# EAGLE schematic brick_serial_ble (EAGLE 7.2.0)
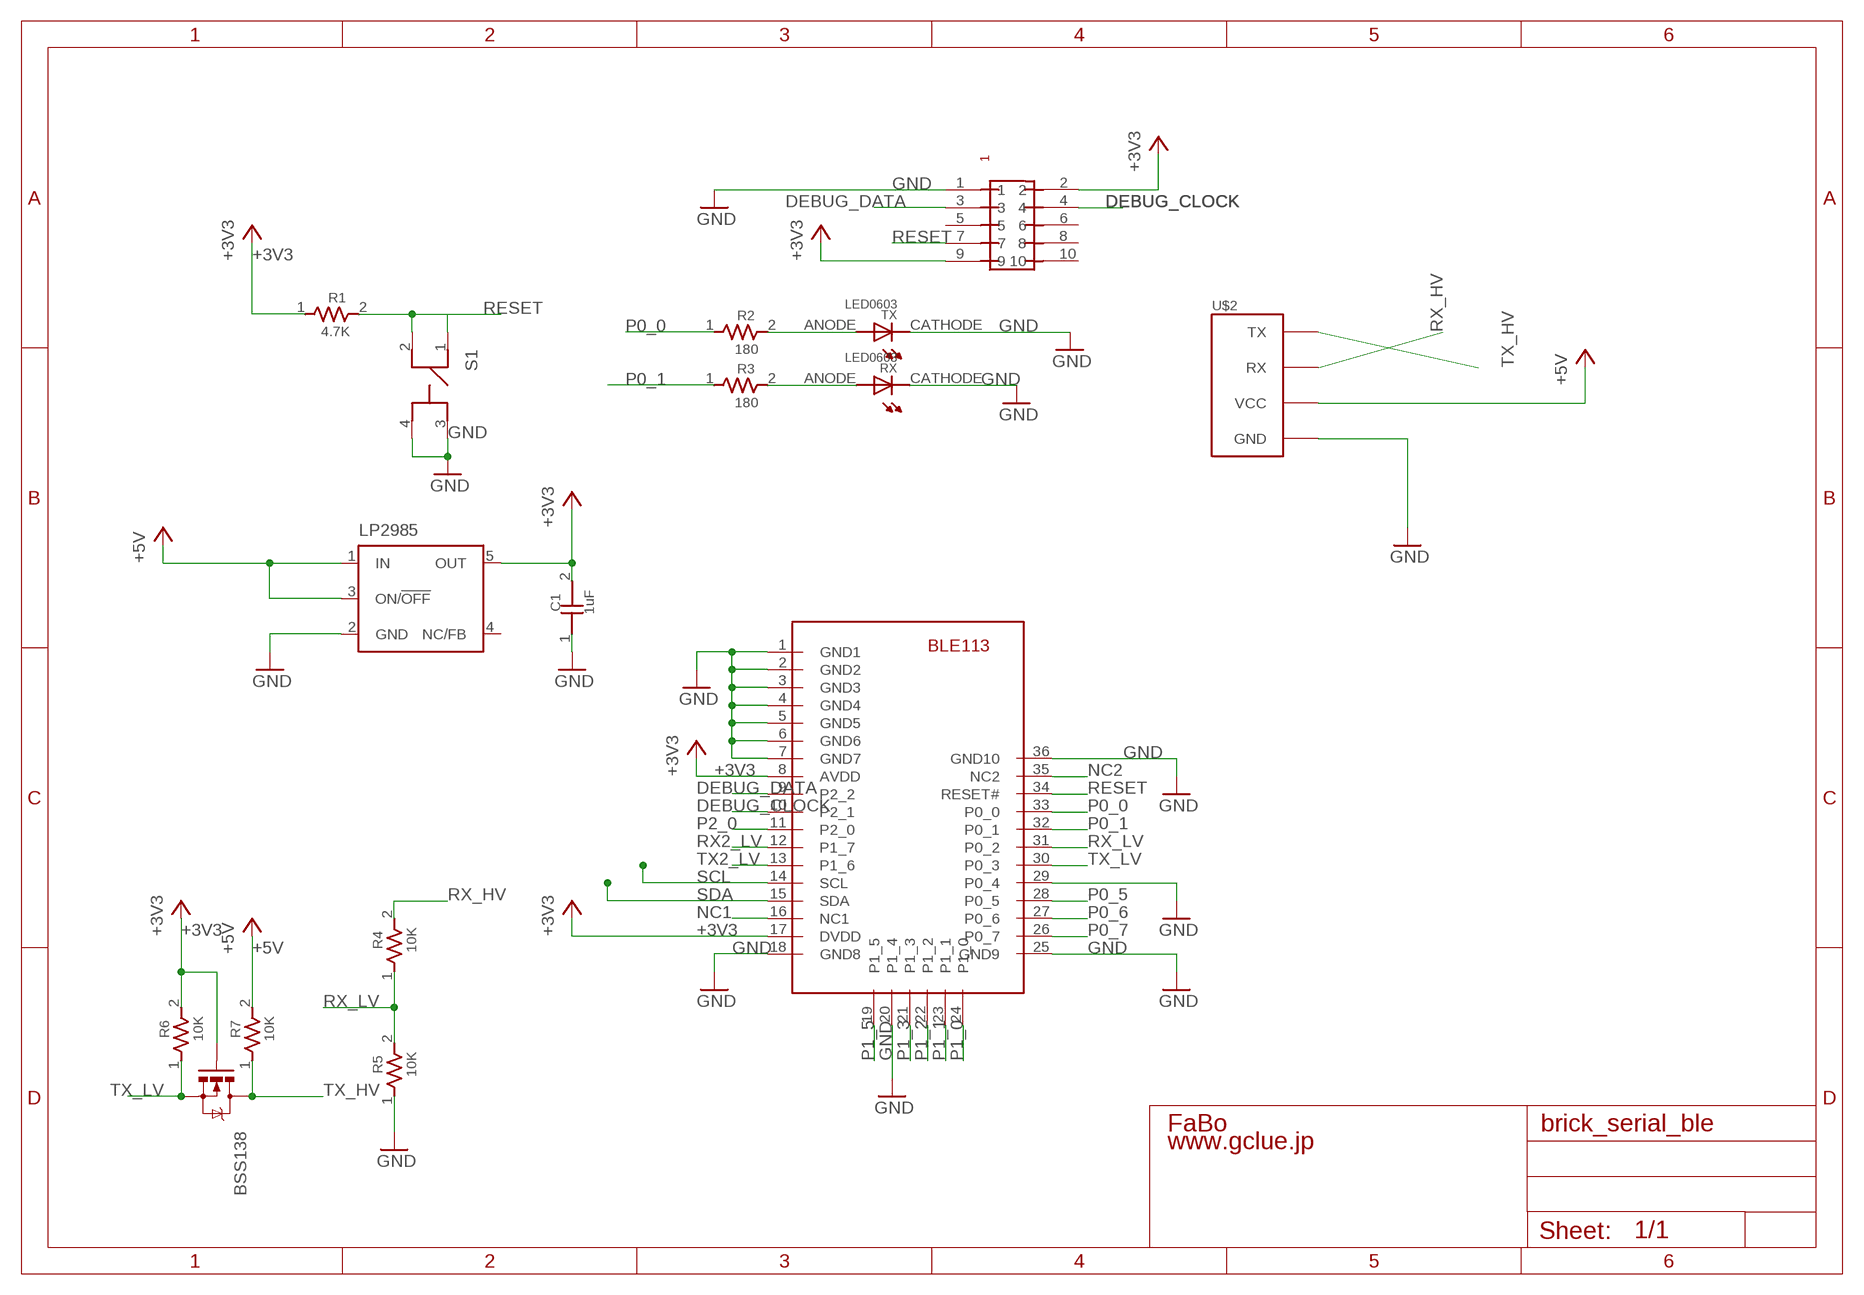
[diagram p0: schematic, sheet 1]

## Parts
BSS138  MOSFET-NCHANNELSMD  [SOT23-3]
C1  1uF  CAPACITOR0603  [0603]
LP2985  LP2985-XXDBVR33  [SOT23-DBV]
R1  4.7K  RESISTOR0603  [0603]
R2  180  RESISTOR0603  [0603]
R3  180  RESISTOR0603  [0603]
R4  10K  RESISTOR0603  [0603]
R5  10K  RESISTOR0603  [0603]
R6  10K  RESISTOR0603  [0603]
R7  10K  RESISTOR0603  [0603]
RX  LED0603  [0603]
S1  SWITCH-LS6J2M-T  [SWITCH-LS6J2M-T]
TX  LED0603  [0603]
U$1  PIN-HEADER-SMT(1.27MM)2X5  [PIN-HEADER-SMT(1.27MM)2X5]
U$2  BRICK_SERIAL  [BRICK_SERIAL]
U$6  BLUEGIGA-BLE113  [BLUEGIGA-BLE113]

## Nets
+3V3: BSS138.1(G) C1.2 LP2985.5(OUT) R1.1 R6.2 U$1.2 U$1.9 U$6.8(AVDD) U$6.17(DVDD)
+5V: LP2985.1(IN) LP2985.3(ON/!OFF) R7.2 U$2.VCC
DEBUG_CLOCK: U$1.4 U$6.10(P2_1)
DEBUG_DATA: U$1.3 U$6.9(P2_2)
GND: C1.1 LP2985.2(GND) R5.1 RX.CATHODE S1.3 S1.4 TX.CATHODE U$1.1 U$2.GND U$6.1(GND1) U$6.2(GND2) U$6.3(GND3) U$6.4(GND4) U$6.5(GND5) U$6.6(GND6) U$6.7(GND7) U$6.18(GND8) U$6.20(P1_4) U$6.25(GND9) U$6.29(P0_4) U$6.36(GND10)
N$1: R2.2 TX.ANODE
N$2: R3.2 RX.ANODE
NC1: U$6.16(NC1)
NC2: U$6.35(NC2)
P0_0: R2.1 U$6.33(P0_0)
P0_1: R3.1 U$6.32(P0_1)
P0_5: U$6.28(P0_5)
P0_6: U$6.27(P0_6)
P0_7: U$6.26(P0_7)
P1_0: U$6.24(P1_0)
P1_1: U$6.23(P1_1)
P1_2: U$6.22(P1_2)
P1_3: U$6.21(P1_3)
P1_5: U$6.19(P1_5)
P2_0: U$6.11(P2_0)
RESET: R1.2 S1.1 S1.2 U$1.7 U$6.34(RESET#)
RX2_LV: U$6.12(P1_7)
RX_HV: R4.2 U$2.RX
RX_LV: R4.1 R5.2 U$6.31(P0_2)
SCL: U$6.14(SCL)
SDA: U$6.15(SDA)
TX2_LV: U$6.13(P1_6)
TX_HV: BSS138.3(D) R7.1 U$2.TX
TX_LV: BSS138.2(S) R6.1 U$6.30(P0_3)
Unconnected: LP2985.4(NC/FB) U$1.5 U$1.6 U$1.8 U$1.10

## Library data of the parts
BSS138 = SparkFun:MOSFET-NCHANNEL
C1 = GClue-Capacitor:CAPACITOR
LP2985 = SmartPrj:LP2985-XXDBVR: ULTRALOW-POWER 50-mA LOW-DROPOUT LINEAR REGULATORS 50-mA Low-Dropout Regulator Source: http://focus.ti.com/lit/ds/symlink/tps77001.pdf
R1-R7 = GClue-Resistors:RESISTOR
RX TX = GClue-LED:LED
S1 = gclue:SWITCH-LS6J2M-T: Switch Tact SMD(LS6J2M-T)
U$1 = gclue:PIN-HEADER-SMT(1.27MM)2X5: PIN-HEADER-SMT (1.27MM) 2x5
U$2 = gclue:BRICK_SERIAL: FaBo Brick 4pin(SERIAL)
U$6 = gclueBT:BLUEGIGA-BLE113: Bluegiga BLE113 Bluetooth Bluetooth 4.0 low energy radio Radio Transmit power: +0 dBm Receiver sensitivity: -93 dBm Typical line-of-sight range: 30 - 100 meters Current Consumption TX peak current: 18.2 mA, 14.3 ma (with DC/DC) RX peak current: 17.9 mA Power mode 1: 270 uA Power mode 2: 1 uA Power mode 3: 0.4 uA Certifications Japan: MIC Japan( 007-AB0103)

## Net classes
0 default: width 0.254 mm, clearance 0.254 mm
2 gnd: width 0.305 mm, drill 0.559 mm, clearance 0.254 mm
3 usbvcc: width 0.508 mm, drill 0.61 mm, clearance 0.254 mm